# Altium schematic sheet PowerDistribution.SchDoc (part 2 of 3)
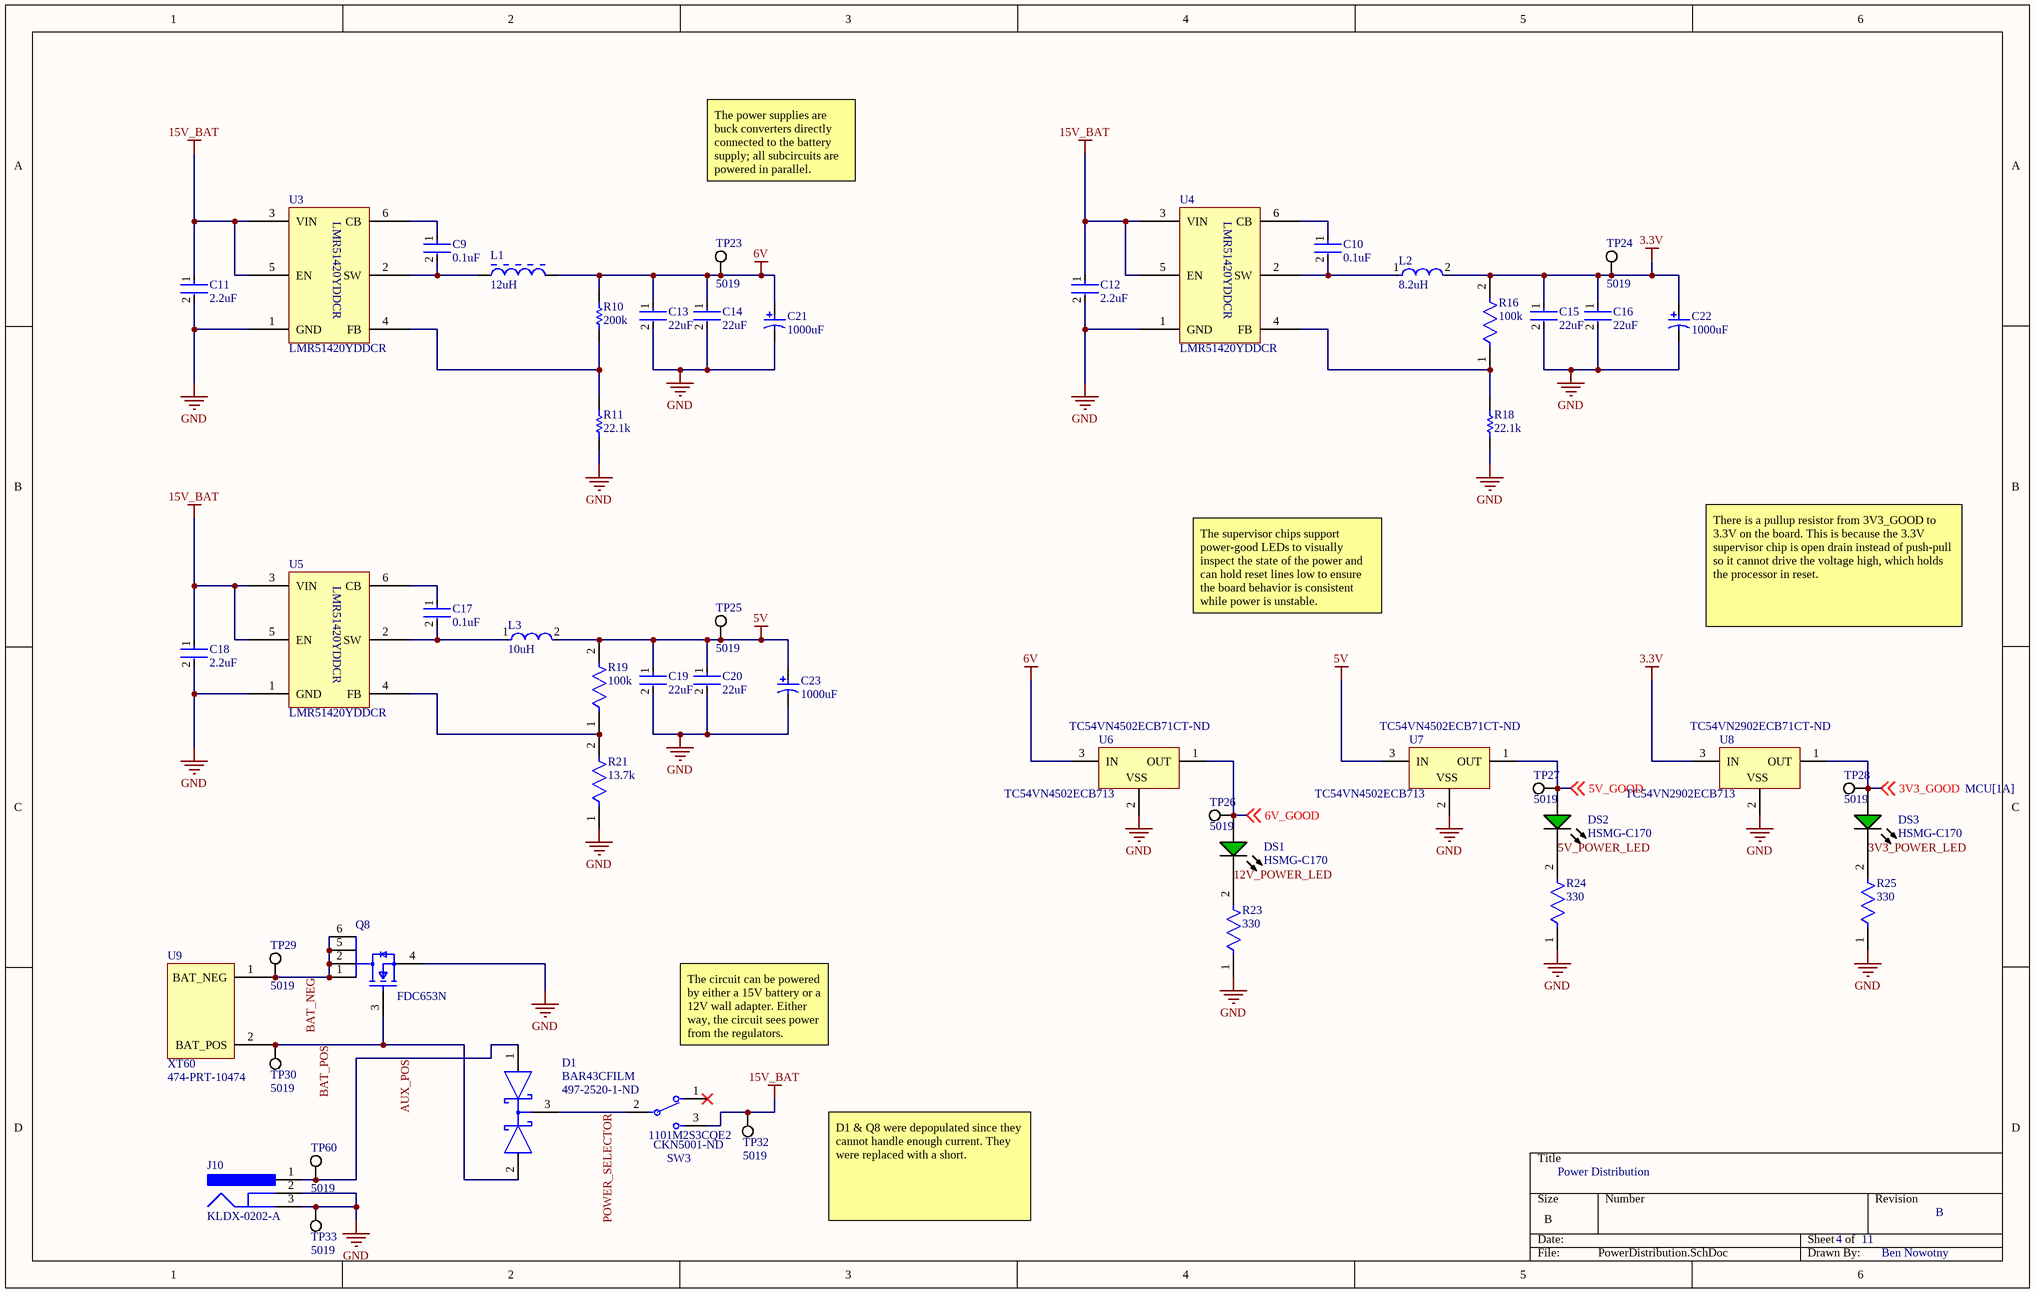
[diagram p1: PowerDistribution.SchDoc]
## Library data of the parts
C9 C10 C17 = CMP-1036-04410-2: CAP CER 0.1UF 25V X7R 0805; Manufacturer Part Number: CC0805KRX7R8BB104; Manufacturer: Yageo; Tolerance: 0.1; Material: Ceramic; Value: 100 nF; Insulation Resistance: 100GR; ComponentLink2URL: http://www.yageo.com/documents/recent/UPY-GPHC_Y5V_6.3V-to-50V_8.pdf; Category: Cap; Mouser Description: Multilayer Ceramic Capacitors MLCC - SMD/SMT 100nF 25V X7R 10%; Device Class L1: Passive Components; Footprint Url: http://www.yageo.com/exep/pages/download/literatures/UPY-C_GEN_24.pdf; Height: 0.95mm; Digikey Description: CAP CER 0.1UF 25V X7R 0805; Lead Free: Yes; Temperature Range High: +85°C; Temperature: -30°C to +85°C; Ipc Land Pattern Name: CAPC200125X85; Capacitance: 100 nF; Automotive: No; Octopart: https://octopart.com/cc0805krx7r8bb104-yageo-39467766; Device Class L2: Capacitors; Temperature Characteristic: X7R; Voltage Rating: 25 V; ComponentLink2Description: Datasheet; Temperature Range Low: -30°C; Device Class L3: Ceramic Capacitors; RoHS: TRUE; Package: CC0805-0.85; Supplier 1: Digi-Key; Supplier Part Number 1: 311-1141-1-ND; Stock 1: 1013369; Pricing 1: 1=0.11000, 10=0.07700, 50=0.04380, 100=0.03620, 500=0.02542, 1000=0.02104 (USD); Mount: Surface Mount; Case/Package: 0805; Number of Pins: 2; Case Code (Metric): 2012; Case Code (Imperial): 0805; Min Operating Temperature: -55°C; Max Operating Temperature: 125°C; Packaging: Tape and Reel; Voltage Rating (DC): 25V; Dielectric: X7R; Package Quantity: 4000; Termination: SMD/SMT; Series: CC; Resistor Type: Ceramic; Length: 2mm; Width: 1.25mm; Depth: 1.25mm; Thickness: 0.033inch; Radiation Hardening: No; RoHS Compliant: Yes; Reach SVHC Compliant: Yes; Halogen Free: Halogen Free; ComponentLink1URL: https://datasheet.ciiva.com/8034/70765-8034031.pdf?src-supplier=Element14; ComponentLink1Description: https://datasheet.ciiva.com/8034/70765-8034031.pdf?src-supplier=Element14; ComponentLink3URL: https://datasheet.ciiva.com/28450/1489800-28450789.pdf?src-supplier=Element14; ComponentLink3Description: https://datasheet.ciiva.com/28450/1489800-28450789.pdf?src-supplier=Element14; ComponentLink4URL: https://datasheet.ciiva.com/46430/1850775-46430166.pdf?src-supplier=Element14; ComponentLink4Description: https://datasheet.ciiva.com/46430/1850775-46430166.pdf?src-supplier=Element14; ComponentLink5URL: https://datasheet.ciiva.com/145/mlccorderingcode-145008.pdf?src-supplier=Digi-Key; ComponentLink5Description: https://datasheet.ciiva.com/145/mlccorderingcode-145008.pdf?src-supplier=Digi-Key; ComponentLink6URL: https://datasheet.ciiva.com/145/mlccorderingcode-145007.pdf?src-supplier=Digi-Key; ComponentLink6Description: https://datasheet.ciiva.com/145/mlccorderingcode-145007.pdf?src-supplier=Digi-Key; ComponentLink7URL: https://datasheet.ciiva.com/145/mlccorderingcode-145009.pdf?src-supplier=Digi-Key; ComponentLink7Description: https://datasheet.ciiva.com/145/mlccorderingcode-145009.pdf?src-supplier=Digi-Key; ComponentLink8URL: https://datasheet.ciiva.com/8034/1784427-8034030.pdf?src-supplier=Element14; ComponentLink8Description: https://datasheet.ciiva.com/8034/1784427-8034030.pdf?src-supplier=Element14
C11 C12 C18 = CMP-08246-001076-1: Cap Ceramic 2.2uF 35V X7R 10% Pad SMD 0805 +125°C Automotive T/R; Manufacturer: TDK; Manufacturer Part Number: CGA4J1X7R1V225K125AC; Width: 0.049inch; Ratings: AEC-Q200; Thickness: 0.057inch; Weight: 0.000194oz; Termination: SMD/SMT; Voltage Rating (DC): 35V; Height: 1.25mm; Case Code (Imperial): 0805; Max Operating Temperature: 125°C; Capacitance: 2.2uF; Dielectric: X7R; Packaging: Tape and Reel; Case Code (Metric): 2012; Voltage Rating: 35V; Mount: Surface Mount; Min Operating Temperature: -55°C; Composition: Ceramic; Tolerance: 10%; REACH SVHC: No SVHC; Case/Package: 0805; Length: 2mm; Depth: 1.25mm; Package Quantity: 1; Supplier 1: Newark; Supplier Part Number 1: 73AH9978; RoHS: Yes; Category: Ceramic Capacitors; Stock 1: 22000; Pricing 1: 1=0.11700, 2000=0.11300, 4000=0.10900, 8000=0.10500, 12000=0.10000 (USD); Series: CGA; Resistor Type: Ceramic; RoHS Compliant: Yes; Reach SVHC Compliant: Yes; ComponentLink1URL: https://datasheet.ciiva.com/24219/cga4j1x7r1v225k125ac-265990-24219578.pdf?src-supplier=Mouser; ComponentLink1Description: https://datasheet.ciiva.com/24219/cga4j1x7r1v225k125ac-265990-24219578.pdf?src-supplier=Mouser
C13-C16 C19 C20 = CMP-2007-03222-3: Chip Multilayer Ceramic Capacitors for General Purpose, 0805, 22uF, X5R, 15%, 20%, 25V; Manufacturer: Murata; Manufacturer Part Number: GRM21BR61E226ME44L; Case/Package: 0805; Depth: 1.25mm; Resistor Type: Ceramic; Voltage Rating: 25V; Lead Free: Lead Free; Voltage Rating (DC): 25V; Case Code (Metric): 2012; Thickness: 0.057inch; REACH SVHC: No SVHC; Material: Ceramic; Tolerance: 20%; Length: 2mm; Capacitance: 22uF; Case Code (Imperial): 0805; Max Operating Temperature: 85°C; Termination: SMD/SMT; Weight: 0.000335oz; Dielectric: X5R; Packaging: Tape and Reel; Voltage: 25V; Package Quantity: 3000; Height: 1.25mm; Mount: Surface Mount; Width: 1.25mm; Min Operating Temperature: -55°C; Supplier 1: Arrow Electronics; Supplier Part Number 1: GRM21BR61E226ME44L; RoHS: Yes; Category: Ceramic Capacitors; Stock 1: 774048; Pricing 1: 3000=0.06440, 6000=0.05980 (USD); Series: GRM; Construction: Flat; RoHS Compliant: Yes; Reach SVHC Compliant: Yes; ComponentLink1URL: http://uk.rs-online.com/webdocs/13d2/0900766b813d2ca1.pdf?src-supplier=Rs; ComponentLink1Description: http://uk.rs-online.com/webdocs/13d2/0900766b813d2ca1.pdf?src-supplier=Rs
C21-C23 = CMP-0687-00006-1: Aluminum Electrolytic Capacitor, UD Series, Low Impedance, 1000 uF, 10 V, + / - 20%, -55 to 105 degC, Chip Type, 10 x 10 mm D x L, Pb-Free, Reel; Manufacturer: Nichicon; PartNumber: UUD1A102MNL1GS; Rated Voltage: 10 V; Endurance Time: 5000 h; Impedance: 0.09 Ohm; Packing: Dia382mm Reel; Tolerance Rated Capacitance: -20 to 20%; Rated Ripple Current (at 100kHz): 670 mA; Dielectric Material: Aluminium; Voltage Rating (DC): 10V; Value: 1mF; Ripple Current: 670mA; Leakage Current: 3uA; Life (Hours): 5000Hour; Dissipation Factor: 0.24%; Lead Diameter: 1.1mm; DatasheetVersion: 08/2012; PackageReference: CAPAE-D10H10; PackageDescription: 2-Pin Surface Mount Device, Diameter 10 mm, Height 10 mm, Pitch 8 mm; ComponentLink3URL: http://products.nichicon.co.jp/en/pdf/XJA043/e-ud.pdf; ComponentLink2Description: Datasheet; Diameter: 10 mm; ComponentLink1Description: Manufacturer URL; RoHS: TRUE; ComponentLink2URL: http://products.nichicon.co.jp/en/pdf/XJA043/e-ud.pdf; Length: 10 mm; Rated Capacitance: 1000 uF; ComponentLink1URL: http://www.nichicon.co.jp/; Mounting Technology: Surface Mount; ComponentLink3Description: Package Specification; Supplier 1: Digi-Key; Supplier Part Number 1: 493-2254-1-ND; Manufacturer Part Number: UUD1A102MNL1GS; Category: Aluminum Electrolytic Capacitors; Stock 1: 3265; Pricing 1: 1=0.94000, 10=0.69100, 50=0.55260, 100=0.47360 (USD); Case/Package: Radial; Pins: 2; Min Operating Temperature: -55°C; Max Operating Temperature: 105°C; Tolerance: 20%; Package Quantity: 1; Packaging: Tape and Reel; Voltage Rating: 10V; Termination: SMD/SMT; Voltage: 10V; Series: UD; Construction: Cylindrical; Ripple Current (AC): 670mA; Height: 10mm; Height - Seated (Max): 0.394inch; Lead Pitch: 4.5mm; Radiation Hardening: No; Reach SVHC Compliant: Yes; RoHS Compliant: Yes; Lead Free: Lead Free; ComponentLink4URL: https://datasheet.ciiva.com/11781/0900766b80fa39e7-11781903.pdf?src-supplier=Rs; ComponentLink4Description: https://datasheet.ciiva.com/11781/0900766b80fa39e7-11781903.pdf?src-supplier=Rs; ComponentLink5URL: https://datasheet.ciiva.com/98/e-ud-98263.pdf?src-supplier=Digi-Key; ComponentLink5Description: https://datasheet.ciiva.com/98/e-ud-98263.pdf?src-supplier=Digi-Key; ComponentLink6URL: https://datasheet.ciiva.com/98/e-ud-98264.pdf?src-supplier=Digi-Key; ComponentLink6Description: https://datasheet.ciiva.com/98/e-ud-98264.pdf?src-supplier=Digi-Key; ComponentLink7URL: https://datasheet.ciiva.com/98/e-ud-98265.pdf?src-supplier=Digi-Key; ComponentLink7Description: https://datasheet.ciiva.com/98/e-ud-98265.pdf?src-supplier=Digi-Key; ComponentLink8URL: https://datasheet.ciiva.com/16502/e-ud-16502759.pdf?src-supplier=Future+Electronics; ComponentLink8Description: https://datasheet.ciiva.com/16502/e-ud-16502759.pdf?src-supplier=Future+Electronics; ComponentLink9URL: https://datasheet.ciiva.com/7793/66055-7793131.pdf?src-supplier=Element14; ComponentLink9Description: https://datasheet.ciiva.com/7793/66055-7793131.pdf?src-supplier=Element14; ComponentLink10URL: https://datasheet.ciiva.com/28458/e-ud-28458024.pdf?src-supplier=Element14; ComponentLink10Description: https://datasheet.ciiva.com/28458/e-ud-28458024.pdf?src-supplier=Element14; ComponentLink11URL: https://datasheet.ciiva.com/22693/66055-22693549.pdf?src-supplier=Element14; ComponentLink11Description: https://datasheet.ciiva.com/22693/66055-22693549.pdf?src-supplier=Element14
D1 = CMP-12187-000004-1: DIODE ARRAY SCHOTTKY 30V SOT23-3; Manufacturer: STMicroelectronics; Peak Reverse Current: 0.5uA; Forward Current: 0.1A; Standoff Height: 0mm; Capacitance: 7pF; Max Surge Forward Current: 0.75A; Value: 7pF; Max Junction Temp: +150°C; Element Configuration: Common Cathode; Max Reverse Current: 500nA; Forward Voltage: 1V; Average Rectified Current: 100mA; Max Forward Surge Current (Ifsm): 750mA; Power Dissipation: 250mW; Reverse Recovery Time: 5ns; ComponentLink2Description: Datasheet; Device Class L2: Diodes; Temperature Range High: +150°C; Device Class L1: Discrete Semiconductors; ComponentLink2URL: https://www.st.com/resource/en/datasheet/bar43.pdf; Package: SOT23-3L; Lead Free: Yes; Temperature: to +150°C; Category: Diode; Digikey Description: DIODE ARRAY SCHOTTKY 30V SOT23-3; Manufacturer Part Number: BAR43CFILM; Automotive: No; Mouser Description: Schottky Diodes & Rectifiers 100mA 30 Volt; Height: 1.5mm; Max Repetitive Reverse Voltage: 30V; RoHS: TRUE; Octopart: https://octopart.com/bar43cfilm-stmicroelectronics-39683191; Device Class L3: Schottky Diodes; Reverse Voltage: 30V; Supplier 1: Digi-Key; Stock 1: 13838; Pricing 1: 1=0.42000, 10=0.31200, 100=0.17680, 500=0.11712, 1000=0.08979 (USD); Mounting Technology: Surface Mount; Case/Package: SOT-23; Pins: 3; Contact Plating: Tin,Matte; Weight: 0.01lb; Min Operating Temperature: -65°C; Max Operating Temperature: 150°C; Packaging: Tape and Reel; Max Repetitive Reverse Voltage (Vrrm): 30V; Package Quantity: 1; Max Reverse Voltage (DC): 30V; Series: -; Peak Non-Repetitive Surge Current: 750mA; Current Rating: 100mA; Voltage Rating (DC): 30V; Termination: SMD/SMT; Length: 2.9mm; Width: 3.05mm; Radiation Hardening: No; RoHS Compliant: Yes; Reach SVHC Compliant: Yes; ComponentLink1URL: https://datasheet.ciiva.com/27050/869700-27050546.pdf?src-supplier=Jameco; ComponentLink1Description: https://datasheet.ciiva.com/27050/869700-27050546.pdf?src-supplier=Jameco; ComponentLink3URL: https://datasheet.ciiva.com/905/cd00000764-905866.pdf?src-supplier=Digi-Key; ComponentLink3Description: https://datasheet.ciiva.com/905/cd00000764-905866.pdf?src-supplier=Digi-Key; ComponentLink4URL: https://datasheet.ciiva.com/905/cd00000764-905867.pdf?src-supplier=Digi-Key; ComponentLink4Description: https://datasheet.ciiva.com/905/cd00000764-905867.pdf?src-supplier=Digi-Key; ComponentLink5URL: https://datasheet.ciiva.com/905/cd00000764-905868.pdf?src-supplier=Digi-Key; ComponentLink5Description: https://datasheet.ciiva.com/905/cd00000764-905868.pdf?src-supplier=Digi-Key; ComponentLink6URL: https://datasheet.ciiva.com/1199/1700360-1199952.pdf?src-supplier=Farnell; ComponentLink6Description: https://datasheet.ciiva.com/1199/1700360-1199952.pdf?src-supplier=Farnell; ComponentLink7URL: https://datasheet.ciiva.com/1199/1700360-1199953.pdf?src-supplier=Farnell; ComponentLink7Description: https://datasheet.ciiva.com/1199/1700360-1199953.pdf?src-supplier=Farnell; ComponentLink8URL: https://datasheet.ciiva.com/1177/1837092-1177592.pdf?src-supplier=Element14; ComponentLink8Description: https://datasheet.ciiva.com/1177/1837092-1177592.pdf?src-supplier=Element14; ComponentLink9URL: https://datasheet.ciiva.com/1177/1837092-1177593.pdf?src-supplier=Element14; ComponentLink9Description: https://datasheet.ciiva.com/1177/1837092-1177593.pdf?src-supplier=Element14; ComponentLink10URL: https://datasheet.ciiva.com/1177/1700360-1177594.pdf?src-supplier=Element14; ComponentLink10Description: https://datasheet.ciiva.com/1177/1700360-1177594.pdf?src-supplier=Element14; ComponentLink11URL: https://datasheet.ciiva.com/16205/cd00000764-16205466.pdf?src-supplier=Future+Electronics; ComponentLink11Description: https://datasheet.ciiva.com/16205/cd00000764-16205466.pdf?src-supplier=Future+Electronics; ComponentLink12URL: https://datasheet.ciiva.com/14558/70013844-14558997.pdf?src-supplier=Allied+Electronics; ComponentLink12Description: https://datasheet.ciiva.com/14558/70013844-14558997.pdf?src-supplier=Allied+Electronics
DS1-DS3 = CMP-2000-05062-1: Chip LED, Green, 2.2 V, -40 to 85 degC, 2-Pin SMD, Pb-Free, Tape and Reel; Manufacturer: Avago; No. of Pins: 2; Peak Wavelength: 570nm; SVHC: NoSVHC(16-Jun-2014); Dominant Wavelength: 572nm; Forward Current If: 20mA; Viewing Angle: 170deg; Lens Shape: Rectangular; PIV Max: 5V; External Width: 1.25mm; LED Type: Standard; External Depth: 0.8mm; Opto Mounting Orientation: Top; Luminous Intensity: 15mcd; Luminous Intensity Min: 4mcd; Forward Voltage VF Max: 2.6V; External Length / Height: 2mm; Bulb Size: 1.25mmx1.4mm; Light Area Height: 1mm; Voltage Vf Typ: 2.2V; Operating Temperature Max: 85degC; Datasheet Version: Oct-08; MSL: MSL2A-4weeks; Peak Forward Current: 20mA; Package Description: 2-Pin Surface Mount Device, Body 2 x 1.25 mm, Height 0.8 mm; Datasheet URL: https://datasheet.ciiva.com/29280/180495-da-01-en-chip-led-hsmg-c170-gelb-gruen-29280971.pdf; Storage Temperature Min: -40degC; LED Colour: Green; Wavelength Typ: 570nm; Mounting Type: SMD; Forward Current If Max: 20mA; Dominant Wavelength Typ: 572nm; LED Mounting: SMD; Operating Temperature Range: -30degCto+85degC; Operating Temperature Min: -30degC; Manufacturer URL: http://www.avagotech.com/; Packaging: CutTape; Luminous Intensity Typ: 15mcd; Package Reference: HSMX-C170; Storage Temperature Max: 85degC; Opto Case Style: SMD; Forward Voltage: 2.2V
J10 = CMP-1673-00001-5: DC Power Jack, 24 V, 3.5 A, -25 to 85 degC, 3-Pin THD, RoHS; Manufacturer: Kycon; Voltage Rating: 24 V; Current Rating: 3.5 A; Option: General Purpose; Rated Current (Power): 3.5A; Pin Diameter: 2mm; DIN Conformance: No; Height: 10.8 mm; Length: 9.2 mm; Pins: 2; Housing Material: PBT; Connector Type: Power; ComponentLink2URL: http://www.kycon.com/Pub_Eng_Draw/KLDX-0202-X.PDF; PackageDescription: 3-Pin Through Hole Device, Body 14.5 x 9 mm; Max Operating Temperature: 85 degC; Min Operating Temperature: -25 degC; PackageReference: KLDX-0202-A; Contact Gender: Female; Package Quantity: 500; Mount: Through Hole; Colour: Black; Contact Plating: Tin; DatasheetVersion: Rev. D3, 06/2013; ComponentLink2Description: Datasheet; RoHSCompliant: true; Mounting Technology: Through Hole; ComponentLink1Description: Manufacturer URL; Contact Material: Brass; ComponentLink1URL: http://www.kycon.com/; Supplier 1: Digi-Key; Supplier Part Number 1: 2092-KLDX-0202-A-ND; Manufacturer Part Number: KLDX-0202-A; RoHS: Yes; Category: Power Connectors; Stock 1: 37787; Pricing 1: 1=0.74000, 10=0.62400, 25=0.59800, 50=0.58540, 100=0.55990, 250=0.50904, 500=0.45814, 1000=0.40723, 2500=0.36906 (USD); Contact Finish - Mating: TIN; Contact Finish - Termination: Matte Tin (Sn); Body/Shell Style: JACK; Termination: Solder; JESD-609 Code: e3; IEC Conformance: No; MIL Conformance: No; Reach SVHC Compliant: Yes; RoHS Compliant: Yes; ComponentLink3URL: https://datasheet.ciiva.com:443/pdfs/VipMasterIC/IC/KYCO/KYCO-S-A0002840624/KYCO-S-A0002840624-1.pdf?src-supplier=IHS+Markit; ComponentLink3Description: https://datasheet.ciiva.com:443/pdfs/VipMasterIC/IC/KYCO/KYCO-S-A0002840624/KYCO-S-A0002840624-1.pdf?src-supplier=IHS+Markit; ComponentLink4URL: http://www.mouser.com/ds/2/222/KLDX_0202_LT-334784.pdf?src-supplier=Mouser; ComponentLink4Description: http://www.mouser.com/ds/2/222/KLDX_0202_LT-334784.pdf?src-supplier=Mouser; ComponentLink5URL: http://domino2.kycon.com/catalog_PDF/KLDX_0202.pdf?src-supplier=Avnet; ComponentLink5Description: http://domino2.kycon.com/catalog_PDF/KLDX_0202.pdf?src-supplier=Avnet
L1 = CMP-0904-00022-1: SDR0403 Series Power Inductor, 12 uF +/- 20 %, 0.21 Ohm, -40 to 125 degC, 2-Pin SMD, RoHS, Tape and Reel; PartNumber: SDR0403-120ML; Manufacturer: Bourns; I rms (A): 1.05 Max.; Q: 28; SRF (MHz): 30 Min.; RDC (Ohm): 0.21 Max.; Tolerance (%): +/- 20; Test Frequency (MHz): 2.52; Inductance (uH): 12; I sat (A): 1.6 Typ.; Core Material: Ferrite; Tolerance: 20%; Self Resonant Frequency: 30MHz; Shielding: Unshielded; DC Resistance (DCR): 210mR; Max DC Current: 1.05A; Test Frequency: 1kHz; Saturation Current: 1.6A; ComponentLink1URL: http://www.bourns.com/; Temperature Range: -40 to 125 degC; ComponentLink2URL: http://www.bourns.com/data/global/pdfs/sdr0403.pdf; Mounting Technology: Surface Mount; Packing: Tape and Reel; PackageDescription: 3-Pin SMD, Dia 4.5 mm, Height 3.5 mm; PackageReference: SDR0403-2; ComponentLink1Description: Manufacturer URL; DatasheetVersion: Feb-12; RoHS: TRUE; ComponentLink2Description: Datasheet; Supplier 1: Digi-Key; Supplier Part Number 1: SDR0403-120MLCT-ND; Manufacturer Part Number: SDR0403-120ML; Category: Fixed Inductors; Stock 1: 15023; Pricing 1: 1=0.62000, 10=0.54100, 25=0.50240, 50=0.42500, 100=0.38630, 250=0.36316, 500=0.32452, 1000=0.26270 (USD); Case/Package: Nonstandard; Min Operating Temperature: -40°C; Max Operating Temperature: 125°C; Value: 12uH; Packaging: Tape and Reel; Inductance Tolerance: 20%; Package Quantity: 2000; Termination: SMD/SMT; Series: SDR0403; RMS Current (Irms): 1.05A; Current Rating: 1.05A; Resistor Type: Wirewound; Q Factor: 28; DC Current: 1.05A; Sample Rate (Hz): 1kHz; Diameter: 4.5mm; Length: 0.177inch; Width: 0.157inch; Height: 3.2mm; Height - Seated (Max): 0.126inch; Depth: 4.3mm; Radiation Hardening: No; RoHS Compliant: Yes; Reach SVHC Compliant: Yes; Military Standard: Not; ComponentLink3URL: https://datasheet.ciiva.com/11802/0900766b80f2b590-11802704.pdf?src-supplier=Rs; ComponentLink3Description: https://datasheet.ciiva.com/11802/0900766b80f2b590-11802704.pdf?src-supplier=Rs; ComponentLink4URL: https://datasheet.ciiva.com/1049/sdr0403-1049176.pdf?src-supplier=Digi-Key; ComponentLink4Description: https://datasheet.ciiva.com/1049/sdr0403-1049176.pdf?src-supplier=Digi-Key; ComponentLink5URL: https://datasheet.ciiva.com/1049/sdr0403-1049177.pdf?src-supplier=Digi-Key; ComponentLink5Description: https://datasheet.ciiva.com/1049/sdr0403-1049177.pdf?src-supplier=Digi-Key; ComponentLink6URL: https://datasheet.ciiva.com/8516/sdr0403-8516071.pdf?src-supplier=Avnet; ComponentLink6Description: https://datasheet.ciiva.com/8516/sdr0403-8516071.pdf?src-supplier=Avnet; ComponentLink7URL: https://datasheet.ciiva.com/22715/1577668-22715399.pdf?src-supplier=Element14; ComponentLink7Description: https://datasheet.ciiva.com/22715/1577668-22715399.pdf?src-supplier=Element14; ComponentLink8URL: https://datasheet.ciiva.com/48956/70153447-48956700.pdf?src-supplier=Allied+Electronics; ComponentLink8Description: https://datasheet.ciiva.com/48956/70153447-48956700.pdf?src-supplier=Allied+Electronics; ComponentLink9URL: https://datasheet.ciiva.com/48690/001056067-da-01-en-leis-indukt-sdr0403-120ml-12uh-1-05a-48690955.pdf?src-supplier=Conrad; ComponentLink9Description: https://datasheet.ciiva.com/48690/001056067-da-01-en-leis-indukt-sdr0403-120ml-12uh-1-05a-48690955.pdf?src-supplier=Conrad
L2 = CMP-07248-000032-1: FIXED IND 8.2UH 2A 180 MOHM SMD; Manufacturer: Bourns; Manufacturer Part Number: SRP4020TA-8R2M; Tolerance: 20%; Shielding: true; Saturation Current: 2.5A; Core Material: Carbonyl Powder; Test Frequency: 100kHz; Series Resistance: 180mΩ; Self Resonant Frequency: 21MHz; Q Factor: 10; Automotive Grade: Grade 0; DC Resistance (DCR): 180mR; Rms Current: 2A; Temperature Range Low: -40°C; Device Class L1: Passive Components; Temperature Range High: +150°C; ComponentLink2URL: https://www.bourns.com/docs/Product-Datasheets/SRP4020TA.pdf; Package: SRP4020TA; Height: 2.1mm; Automotive: Yes; Digikey Description: FIXED IND 8.2UH 2A 180 MOHM SMD; Device Class L3: Fixed Inductors; Device Class L2: Inductors; Temperature: -40°C to +150°C; Composition: Wirewound; Inductance: 8.2uH; Lead Free: Yes; Mouser Description: Fixed Inductors 8.2uH 20% SMD 4020 AEC-Q200; Category: Ind; RoHS: TRUE; Value: 8.2uH; ComponentLink2Description: Datasheet; Octopart: https://octopart.com/srp4020ta-8r2m-bourns-47300342; Supplier 1: Digi-Key; Supplier Part Number 1: SRP4020TA-8R2MCT-ND; Stock 1: 13839; Pricing 1: 1=1.35000, 10=1.25700, 25=1.16040, 50=0.96700, 100=0.90910, 250=0.81236, 500=0.69630, 1000=0.61893 (USD); Mount: Surface Mount; Case/Package: SMD/SMT; Number of Pins: 2; Weight: 0.005291oz; Min Operating Temperature: -40°C; Max Operating Temperature: 150°C; Inductance Tolerance: 20%; Packaging: Tape and Reel; Current Rating: 2A; Max DC Current: 2.5A; Package Quantity: 3000; Series: SRP4020TA; Termination: SMD/SMT; RMS Current (Irms): 2A; Resistor Type: Wirewound; Length: 0.175inch; Width: 4.06mm; Height - Seated (Max): 0.079inch; Depth: 4.06mm; Ratings: AEC-Q200; RoHS Compliant: Yes; Reach SVHC Compliant: Yes; ComponentLink1URL: https://datasheet.ciiva.com/46437/1839010-46437192.pdf?src-supplier=Element14; ComponentLink1Description: https://datasheet.ciiva.com/46437/1839010-46437192.pdf?src-supplier=Element14; ComponentLink3URL: https://datasheet.ciiva.com/46437/1839010-46437191.pdf?src-supplier=Element14; ComponentLink3Description: https://datasheet.ciiva.com/46437/1839010-46437191.pdf?src-supplier=Element14
L3 = CMP-14484-000421-1: SMD Inductors 10uH ±10% 0.15A 0.468Ω 0805; Manufacturer: Taiyo Yuden; Manufacturer Part Number: LBR2012T100K; DC Current: 150mA; Core Material: Ferrite; Shielding: Unshielded; Test Frequency: 2.52MHz; DC Resistance (DCR): 360mR; Self Resonant Frequency: 32MHz; Military Standard: Not; Termination: SMD/SMT; Height - Seated (Max): 0.057inch; Current Rating: 150mA; Tolerance: 10%; Case Code (Imperial): 0805; Radiation Hardening: No; Inductance: 10uH; Resistor Type: Wirewound; Length: 0.079inch; Weight: 0.000194oz; Case Code (Metric): 2012; Max Operating Temperature: 105°C; Height: 1.6mm; Packaging: Tape and Reel; Lead Pitch: 1mm; Case/Package: 0805; Depth: 1.45mm; Series: LB; Mount: Surface Mount; Min Operating Temperature: -40°C; Inductance Tolerance: 10%; RoHS Compliant: Yes; Max DC Current: 150mA; Package Quantity: 3000; Lead Free: Lead Free; Width: 1.6mm; Halogen Free: Halogen Free; Supplier 1: Digi-Key; Supplier Part Number 1: 587-2045-1-ND; RoHS: Yes; Category: Fixed Inductors; Stock 1: 225887; Pricing 1: 1=0.13000, 10=0.11400, 25=0.10080, 50=0.08580, 100=0.07580, 250=0.06944, 500=0.06312, 1000=0.05302 (USD); ComponentLink1URL: https://datasheet.ciiva.com/28479/1521622-28479584.pdf?src-supplier=Element14; ComponentLink1Description: https://datasheet.ciiva.com/28479/1521622-28479584.pdf?src-supplier=Element14; ComponentLink2URL: https://datasheet.ciiva.com/1038/lbr2012t100k-ss-1038898.pdf?src-supplier=Digi-Key; ComponentLink2Description: https://datasheet.ciiva.com/1038/lbr2012t100k-ss-1038898.pdf?src-supplier=Digi-Key; ComponentLink3URL: https://datasheet.ciiva.com/3082/lbr2012t100k-ss-3082080.pdf?src-supplier=Avnet; ComponentLink3Description: https://datasheet.ciiva.com/3082/lbr2012t100k-ss-3082080.pdf?src-supplier=Avnet; ComponentLink4URL: https://datasheet.ciiva.com/15986/291lbr2012t100k-15986593.pdf?src-supplier=Onlinecomponents.com; ComponentLink4Description: https://datasheet.ciiva.com/15986/291lbr2012t100k-15986593.pdf?src-supplier=Onlinecomponents.com
Q8 = CMP-07173-000050-1: MOSFET N-CH 30V 5A SSOT-6; Manufacturer: ON Semiconductor; Drain To Source Resistance: 0.027Ω; Max Forward Diode Voltage: 1.2V; Turn Off Delay Time: 13ns; Rthja Max: 78°C/W; Typ Forward Diode Voltage: 0.75V; Pulse Drain Current: 15A; Power Dissipation: 1.6W; Gate Charge At Vgs: 12nC @ 10V; Gate To Source Voltage: 20V; Input Capacitace At Vds: 350pF @ 15V; Max Junction Temp: +150°C; Turn On Delay Time: 7.5ns; Number Of Channels: 1; Transconductance: 6.2S; Threshold Vgs Min: 1V; Threshold Vgs Max: 2V; Depletion Mode: False; Standoff Height: 0mm; Height: 1.1mm; Device Class L2: Transistors; ComponentLink2URL: https://www.onsemi.com/pub/Collateral/FDC653N-D.pdf; Temperature: -55°C to +150°C; Mouser Description: Supplied as a Tape, FDC653N N-Channel MOSFET, 5 A, 30 V, 6-Pin SOT-23 ON Semiconductor; Drain To Source Breakdown Voltage: 30V; Category: Trans; Drain To Source Voltage: 30V; Digikey Description: MOSFET N-CH 30V 5A SSOT-6; Automotive: No; ComponentLink2Description: Datasheet; Device Class L1: Discrete Semiconductors; Manufacturer Part Number: FDC653N; Footprint Url: https://www.onsemi.com/pub/Collateral/419BL.PDF; Continuous Drain Current: 5A; Lead Free: Yes; RoHS: TRUE; Number Of N Channels: 1; Ipc Land Pattern Name: SOT95P280X100-6; Package: 419BL; Temperature Range High: +150°C; Temperature Range Low: -55°C; Octopart: https://octopart.com/fdc653n-on+semiconductor-84325763; Device Class L3: MOSFETs
R10 = CMP-2001-03660-1: Part Number: CRCW0805200KFKEA; Manufacturer: Vishay Dale; Tolerance: 1%; Power Rating: 125mW; Value: 200kR; Voltage Rating: 150V; Temperature Coefficient: 100ppm/°C; Supplier 1: Digi-Key; Supplier Part Number 1: 541-200KCCT-ND; Manufacturer Part Number: CRCW0805200KFKEA; RoHS: Yes; Category: Chip SMD Resistors; Stock 1: 34940; Pricing 1: 1=0.10000, 10=0.06700, 100=0.02710, 1000=0.01219, 2500=0.01058 (USD); Case/Package: 0805; Case Code (Metric): 2012; Case Code (Imperial): 0805; Contact Plating: Tin; Weight: 0.000194oz; Min Operating Temperature: -55°C; Max Operating Temperature: 155°C; Resistor Type: Thick Film; Packaging: Tape and Reel; Package Quantity: 10; Number of Terminations: 2; Termination: SMD/SMT; Max Power Dissipation: 125mW; Voltage Rating (DC): 150V; Features: Automotive AEC-Q200; Series: CRCW; Construction: Rectangular; Technology: THICK FILM; Resistance Tolerance: 1%; Length: 2mm; Width: 0.049inch; Height: 0.45mm; Depth: 1.25mm; Ratings: AEC-Q200; Radiation Hardening: No; Military Standard: Not; Lead Free: Lead Free; RoHS Compliant: Yes; ComponentLink1URL: https://datasheet.ciiva.com/11809/0900766b80d98b26-11809762.pdf?src-supplier=Rs; ComponentLink1Description: https://datasheet.ciiva.com/11809/0900766b80d98b26-11809762.pdf?src-supplier=Rs; ComponentLink2URL: https://datasheet.ciiva.com/3258/dcrcwe3-3258299.pdf?src-supplier=Avnet; ComponentLink2Description: https://datasheet.ciiva.com/3258/dcrcwe3-3258299.pdf?src-supplier=Avnet; ComponentLink3URL: https://datasheet.ciiva.com/3258/dcrcwe3-3258300.pdf?src-supplier=Avnet; ComponentLink3Description: https://datasheet.ciiva.com/3258/dcrcwe3-3258300.pdf?src-supplier=Avnet; ComponentLink4URL: https://datasheet.ciiva.com/2514/dcrcwe3-2514355.pdf?src-supplier=Digi-Key; ComponentLink4Description: https://datasheet.ciiva.com/2514/dcrcwe3-2514355.pdf?src-supplier=Digi-Key; ComponentLink5URL: https://datasheet.ciiva.com/2514/dcrcwe3-2514356.pdf?src-supplier=Digi-Key; ComponentLink5Description: https://datasheet.ciiva.com/2514/dcrcwe3-2514356.pdf?src-supplier=Digi-Key; ComponentLink6URL: https://datasheet.ciiva.com/2514/dcrcwe3-2514357.pdf?src-supplier=Digi-Key; ComponentLink6Description: https://datasheet.ciiva.com/2514/dcrcwe3-2514357.pdf?src-supplier=Digi-Key; ComponentLink7URL: https://datasheet.ciiva.com/7714/1697337-7714298.pdf?src-supplier=Element14; ComponentLink7Description: https://datasheet.ciiva.com/7714/1697337-7714298.pdf?src-supplier=Element14; ComponentLink8URL: https://datasheet.ciiva.com/16427/dcrcwe3-16427628.pdf?src-supplier=Future+Electronics; ComponentLink8Description: https://datasheet.ciiva.com/16427/dcrcwe3-16427628.pdf?src-supplier=Future+Electronics; ComponentLink9URL: https://datasheet.ciiva.com/7714/1720486-7714381.pdf?src-supplier=Element14; ComponentLink9Description: https://datasheet.ciiva.com/7714/1720486-7714381.pdf?src-supplier=Element14; ComponentLink10URL: https://datasheet.ciiva.com/16721/70201119-16721487.pdf?src-supplier=Allied+Electronics; ComponentLink10Description: https://datasheet.ciiva.com/16721/70201119-16721487.pdf?src-supplier=Allied+Electronics; ComponentLink11URL: https://datasheet.ciiva.com/16787/70201119-16787767.pdf?src-supplier=Allied+Electronics; ComponentLink11Description: https://datasheet.ciiva.com/16787/70201119-16787767.pdf?src-supplier=Allied+Electronics
R11 = CMP-2001-00049-1: Part Number: ERJ-6ENF2212V; Manufacturer: Panasonic; Value: 22.1kR; Power Rating: 125mW; Tolerance: 1%; Voltage Rating: 150V; Temperature Coefficient: 100ppm/°C; Supplier 1: Digi-Key; Supplier Part Number 1: P22.1KCCT-ND; Manufacturer Part Number: ERJ-6ENF2212V; RoHS: Yes; Category: Chip SMD Resistors; Stock 1: 163702; Pricing 1: 1=0.10000, 10=0.09200, 100=0.03540, 1000=0.01558, 2500=0.01345 (USD); Mounting Technology: Surface Mount; Case/Package: 0805; Case Code (Metric): 2012; Case Code (Imperial): 0805; Contact Plating: Tin; Weight: 0.000194oz; Min Operating Temperature: -55°C; Max Operating Temperature: 155°C; Packaging: Tape and Reel; Termination: SMD/SMT; Max Power Dissipation: 125mW; Series: ERJ; Resistance Tolerance: 1%; Resistor Type: Thick Film; Number of Terminations: 2; Voltage Rating (DC): 150V; Package Quantity: 1; Features: Automotive AEC-Q200; Technology: THICK FILM; Construction: Rectangular; Length: 2mm; Width: 1.2mm; Height: 0.6mm; Depth: 1.25mm; Radiation Hardening: No; Reach SVHC Compliant: Yes; Lead Free: Lead Free; RoHS Compliant: Yes; Military Standard: Not; ComponentLink1URL: https://datasheet.ciiva.com/11821/0900766b80f80784-11821597.pdf?src-supplier=Rs; ComponentLink1Description: https://datasheet.ciiva.com/11821/0900766b80f80784-11821597.pdf?src-supplier=Rs
R16 R19 = CMP-2100-03668-5: RES 100K OHM 1% 1/8W 0805; Manufacturer: Yageo; Manufacturer Part Number: RC0805FR-07100KL; Power Rating: 125mW; Temperature Coefficient: 100ppm/°C; Voltage Rating (DC): 150V; Resistance: 100kR; Package Quantity: 1; Case/Package: 0805; Lead Pitch: 0.4mm; Case Code (Imperial): 0805; Construction: Rectangular; Number of Terminations: 2; RoHS Compliant: Yes; Max Power Dissipation: 125mW; Tolerance: 1%; Max Operating Temperature: 155°C; Resistance Tolerance: 1%; Lead Free: Lead Free; Packaging: Tape and Reel; Resistor Type: Thick Film; Min Operating Temperature: -55°C; Case Code (Metric): 2012; Series: RC; Technology: THICK FILM; Voltage Rating: 150V; Termination: SMD/SMT; Width: 0.049inch; Number of Pins: 2; Features: Moisture Resistant; Military Standard: Not; Length: 0.079inch; Depth: 1.25mm; Size Code: 0805; Height: 0.024inch; Supplier 1: Digi-Key; Supplier Part Number 1: 311-100KCRCT-ND; RoHS: Yes; Category: Chip SMD Resistors; Stock 1: 5914890; Pricing 1: 1=0.10000, 10=0.03300, 100=0.01330, 1000=0.00600, 2500=0.00520 (USD)
R18 = CMP-2001-00049-1: Part Number: ERJ-6ENF2212V; Manufacturer: Panasonic; Resistance: 22.1kR; Tolerance: 1%; Temperature Coefficient: 100ppm/°C; Power Rating: 125mW; Voltage Rating (DC): 150V; Supplier 1: Digi-Key; Supplier Part Number 1: P22.1KCCT-ND; Manufacturer Part Number: ERJ-6ENF2212V; RoHS: Yes; Category: Chip SMD Resistors; Stock 1: 158902; Pricing 1: 1=0.10000, 10=0.09200, 100=0.03540, 1000=0.01558, 2500=0.01345 (USD); Mount: Surface Mount; Case/Package: 0805; Case Code (Metric): 2012; Case Code (Imperial): 0805; Contact Plating: Tin; Size Code: 0805; Weight: 0.000194oz; Min Operating Temperature: -55°C; Max Operating Temperature: 155°C; Packaging: Tape and Reel; Resistor Type: Thick Film; Number of Terminations: 2; Max Power Dissipation: 125mW; Series: ERJ; Voltage Rating: 150V; Package Quantity: 1; Termination: SMD/SMT; Features: Automotive AEC-Q200; Construction: Rectangular; Resistance Tolerance: 1%; Technology: THICK FILM; Length: 2mm; Width: 1.2mm; Height: 0.6mm; Depth: 1.25mm; Radiation Hardening: No; RoHS Compliant: Yes; Lead Free: Lead Free; Military Standard: Not; Reach SVHC Compliant: Yes; ComponentLink1URL: https://datasheet.ciiva.com/11821/0900766b80f80784-11821597.pdf?src-supplier=Rs; ComponentLink1Description: https://datasheet.ciiva.com/11821/0900766b80f80784-11821597.pdf?src-supplier=Rs; ComponentLink2URL: https://datasheet.ciiva.com/36526/1989172-36526235.pdf?src-supplier=Jameco; ComponentLink2Description: https://datasheet.ciiva.com/36526/1989172-36526235.pdf?src-supplier=Jameco; ComponentLink3URL: https://datasheet.ciiva.com/43460/426256-43460056.pdf?src-supplier=Farnell; ComponentLink3Description: https://datasheet.ciiva.com/43460/426256-43460056.pdf?src-supplier=Farnell; ComponentLink4URL: https://datasheet.ciiva.com/6064/426256-6064649.pdf?src-supplier=Farnell; ComponentLink4Description: https://datasheet.ciiva.com/6064/426256-6064649.pdf?src-supplier=Farnell; ComponentLink5URL: https://datasheet.ciiva.com/46377/426256-46377962.pdf?src-supplier=Element14; ComponentLink5Description: https://datasheet.ciiva.com/46377/426256-46377962.pdf?src-supplier=Element14; ComponentLink6URL: https://datasheet.ciiva.com/28693/1678782-28693597.pdf?src-supplier=Element14; ComponentLink6Description: https://datasheet.ciiva.com/28693/1678782-28693597.pdf?src-supplier=Element14; ComponentLink7URL: https://datasheet.ciiva.com/24158/aoa0000ce2-24158937.pdf?src-supplier=Mouser; ComponentLink7Description: https://datasheet.ciiva.com/24158/aoa0000ce2-24158937.pdf?src-supplier=Mouser; ComponentLink8URL: https://datasheet.ciiva.com/16724/70260748-16724650.pdf?src-supplier=Allied+Electronics; ComponentLink8Description: https://datasheet.ciiva.com/16724/70260748-16724650.pdf?src-supplier=Allied+Electronics; ComponentLink9URL: https://datasheet.ciiva.com/16782/70260748-16782763.pdf?src-supplier=Allied+Electronics; ComponentLink9Description: https://datasheet.ciiva.com/16782/70260748-16782763.pdf?src-supplier=Allied+Electronics; ComponentLink10URL: https://datasheet.ciiva.com/9191/aoa0000ce2-9191797.pdf?src-supplier=Avnet; ComponentLink10Description: https://datasheet.ciiva.com/9191/aoa0000ce2-9191797.pdf?src-supplier=Avnet; ComponentLink11URL: https://datasheet.ciiva.com/30201/aoa0000ce2-30201590.pdf?src-supplier=Onlinecomponents.com; ComponentLink11Description: https://datasheet.ciiva.com/30201/aoa0000ce2-30201590.pdf?src-supplier=Onlinecomponents.com
R21 = CMP-2001-04947-2: RES Thick Film, 13.7kΩ, 1%, 0.125W, 100ppm/°C, 0805; Manufacturer: Vishay; Manufacturer Part Number: CRCW080513K7FKEA; Voltage Rating (DC): 150V; Max Power Dissipation: 125mW; Resistance: 13.7kR; Min Operating Temperature: -55°C; Composition: Thick Film; Contact Plating: Tin; Depth: 1.25mm; Max Operating Temperature: 155°C; Case Code (Metric): 2012; Lead Free: Lead Free; Tolerance: 1%; Case Code (Imperial): 0805; Voltage Rating: 150V; Weight: 0.000194oz; Case/Package: 0805; Radiation Hardening: No; Package Quantity: 10; Features: Automotive AEC-Q200; Temperature Coefficient: 100ppm/°C; Width: 0.049inch; Packaging: Tape and Reel; Number of Pins: 2; Termination: SMD/SMT; Height: 0.45mm; Number of Terminations: 2; Power Rating: 125mW; Length: 2mm; Military Standard: Not; Supplier 1: Digi-Key; Supplier Part Number 1: 541-13.7KCCT-ND; RoHS: Yes; Category: Chip SMD Resistors; Stock 1: 15384; Pricing 1: 1=0.10000, 10=0.06700, 100=0.02710, 1000=0.01219, 2500=0.01058 (USD); Size Code: 0805; Resistor Type: Thick Film; Series: CRCW; Resistance Tolerance: 1%; Construction: Rectangular; Technology: THICK FILM; RoHS Compliant: Yes; ComponentLink1URL: https://datasheet.ciiva.com/11810/0900766b80d98b26-11810040.pdf?src-supplier=Rs; ComponentLink1Description: https://datasheet.ciiva.com/11810/0900766b80d98b26-11810040.pdf?src-supplier=Rs; ComponentLink2URL: https://datasheet.ciiva.com/2467/dcrcwe3-2467845.pdf?src-supplier=Digi-Key; ComponentLink2Description: https://datasheet.ciiva.com/2467/dcrcwe3-2467845.pdf?src-supplier=Digi-Key; ComponentLink3URL: https://datasheet.ciiva.com/2467/dcrcwe3-2467846.pdf?src-supplier=Digi-Key; ComponentLink3Description: https://datasheet.ciiva.com/2467/dcrcwe3-2467846.pdf?src-supplier=Digi-Key; ComponentLink4URL: https://datasheet.ciiva.com/2467/dcrcwe3-2467847.pdf?src-supplier=Digi-Key; ComponentLink4Description: https://datasheet.ciiva.com/2467/dcrcwe3-2467847.pdf?src-supplier=Digi-Key; ComponentLink5URL: https://datasheet.ciiva.com/3258/dcrcwe3-3258107.pdf?src-supplier=Avnet; ComponentLink5Description: https://datasheet.ciiva.com/3258/dcrcwe3-3258107.pdf?src-supplier=Avnet; ComponentLink6URL: https://datasheet.ciiva.com/5543/dcrcwe3-109170-5543941.pdf?src-supplier=Mouser; ComponentLink6Description: https://datasheet.ciiva.com/5543/dcrcwe3-109170-5543941.pdf?src-supplier=Mouser; ComponentLink7URL: https://datasheet.ciiva.com/7663/1697337-7663928.pdf?src-supplier=Element14; ComponentLink7Description: https://datasheet.ciiva.com/7663/1697337-7663928.pdf?src-supplier=Element14; ComponentLink8URL: https://datasheet.ciiva.com/16396/dcrcw-16396310.pdf?src-supplier=Future+Electronics; ComponentLink8Description: https://datasheet.ciiva.com/16396/dcrcw-16396310.pdf?src-supplier=Future+Electronics; ComponentLink9URL: https://datasheet.ciiva.com/22675/1847332-22675191.pdf?src-supplier=Element14; ComponentLink9Description: https://datasheet.ciiva.com/22675/1847332-22675191.pdf?src-supplier=Element14; ComponentLink10URL: https://datasheet.ciiva.com/16778/70201119-16778860.pdf?src-supplier=Allied+Electronics; ComponentLink10Description: https://datasheet.ciiva.com/16778/70201119-16778860.pdf?src-supplier=Allied+Electronics
R23-R25 = CMP-2001-03823-2: RES Thick Film, 330Ω, 1%, 0.125W, 100ppm/°C, 0805; Manufacturer: Vishay; Manufacturer Part Number: CRCW0805330RFKEA; Voltage Rating (DC): 150V; Resistance: 330R; Max Power Dissipation: 125mW; Mount: Surface Mount; Packaging: Tape and Reel; Min Operating Temperature: -55°C; Military Standard: Not; Case Code (Metric): 2012; Height: 0.02inch; Voltage Rating: 150V; Case/Package: 0805; Max Operating Temperature: 155°C; Width: 0.049inch; Case Code (Imperial): 0805; Termination: SMD/SMT; Lead Free: Lead Free; Contact Plating: Tin; Package Quantity: 10; Composition: Thick Film; Length: 2mm; Features: Automotive AEC-Q200; Depth: 1.25mm; Weight: 0.000194oz; Tolerance: 1%; Power Rating: 125mW; Number of Terminations: 2; Temperature Coefficient: 100ppm/°C; Supplier 1: Digi-Key; Supplier Part Number 1: 541-330CCT-ND; RoHS: Yes; Category: Chip SMD Resistors; Stock 1: 1889; Pricing 1: 1=0.10000, 10=0.06700, 100=0.02710, 1000=0.01219, 2500=0.01058 (USD); Size Code: 0805; Series: CRCW; Resistor Type: Thick Film; Construction: Rectangular; Resistance Tolerance: 1%; Ratings: AEC-Q200; RoHS Compliant: Yes; ComponentLink1URL: https://datasheet.ciiva.com/8944/dcrcwe3-8944773.pdf?src-supplier=Avnet; ComponentLink1Description: https://datasheet.ciiva.com/8944/dcrcwe3-8944773.pdf?src-supplier=Avnet; ComponentLink2URL: https://datasheet.ciiva.com/8944/dcrcwe3-8944776.pdf?src-supplier=Avnet; ComponentLink2Description: https://datasheet.ciiva.com/8944/dcrcwe3-8944776.pdf?src-supplier=Avnet; ComponentLink3URL: https://datasheet.ciiva.com/2495/dcrcwe3-2495803.pdf?src-supplier=Digi-Key; ComponentLink3Description: https://datasheet.ciiva.com/2495/dcrcwe3-2495803.pdf?src-supplier=Digi-Key; ComponentLink4URL: https://datasheet.ciiva.com/2495/dcrcwe3-2495804.pdf?src-supplier=Digi-Key; ComponentLink4Description: https://datasheet.ciiva.com/2495/dcrcwe3-2495804.pdf?src-supplier=Digi-Key; ComponentLink5URL: https://datasheet.ciiva.com/2495/dcrcwe3-2495805.pdf?src-supplier=Digi-Key; ComponentLink5Description: https://datasheet.ciiva.com/2495/dcrcwe3-2495805.pdf?src-supplier=Digi-Key; ComponentLink6URL: https://datasheet.ciiva.com/5545/dcrcwe3-109170-5545357.pdf?src-supplier=Mouser; ComponentLink6Description: https://datasheet.ciiva.com/5545/dcrcwe3-109170-5545357.pdf?src-supplier=Mouser; ComponentLink7URL: https://datasheet.ciiva.com/16769/70201119-16769852.pdf?src-supplier=Allied+Electronics; ComponentLink7Description: https://datasheet.ciiva.com/16769/70201119-16769852.pdf?src-supplier=Allied+Electronics; ComponentLink8URL: https://datasheet.ciiva.com/7777/1697337-7777390.pdf?src-supplier=Element14; ComponentLink8Description: https://datasheet.ciiva.com/7777/1697337-7777390.pdf?src-supplier=Element14; ComponentLink9URL: https://datasheet.ciiva.com/7777/1720486-7777573.pdf?src-supplier=Element14; ComponentLink9Description: https://datasheet.ciiva.com/7777/1720486-7777573.pdf?src-supplier=Element14
SW3 = CMP-10038-000019-1: SWITCH SLIDE SPDT 6A 120V; Manufacturer: ITT C&K; Switch Travel: 2.16mm; Number of Positions: 3; Number of Poles: 1; Approvals: UL; Actuator Length: 5.08mm; Voltage Rating (DC): 28V; Max Voltage Rating (AC): 250V; Insulation Resistance: 1GR; Body Material: Stainless Steel; Actuator Type: Standard; Contact Resistance: 10mR; Switch Function: On-On; Actuator Material: Nylon; Actuator Color: Black; Electrical Life: 40000Cycles; Termination: PC Pins; Packaging: Bulk; Housing Material: Stainless Steel; Flammability Rating: UL94 V-0; Series: 1000; Contact Current Rating: 6A; Length: 12.7mm; Depth: 6.6mm; Orientation: Vertical; Max Current Rating: 6A; Max Operating Temperature: 65°C; Throw Configuration: SPDT; REACH SVHC: No SVHC; Contact Material: Copper; Max Voltage Rating (DC): 28V; Lead Free: Lead Free; Current Rating: 6A; Voltage Rating (AC): 120V; Contact Plating: Silver; Package Quantity: 1; Min Operating Temperature: -30°C; Mount: Through Hole; Supplier 1: Digi-Key; Manufacturer Part Number: 1101M2S3CQE2; RoHS: Yes; Category: Slide Switches; Stock 1: 33215; Pricing 1: 1=4.21000, 10=4.03300, 25=3.68200, 100=3.19110, 250=2.89304, 500=2.68264, 1000=2.48977, 2500=2.26184 (USD); Mounting Technology: Through Hole,PCB; Reach SVHC Compliant: Yes; RoHS Compliant: Yes; ComponentLink1URL: https://datasheet.ciiva.com/1223/1719937-1223387.pdf?src-supplier=Element14; ComponentLink1Description: https://datasheet.ciiva.com/1223/1719937-1223387.pdf?src-supplier=Element14; ComponentLink2URL: https://datasheet.ciiva.com/1194/1000-30jul14-1194577.pdf?src-supplier=Newark; ComponentLink2Description: https://datasheet.ciiva.com/1194/1000-30jul14-1194577.pdf?src-supplier=Newark; ComponentLink3URL: https://datasheet.ciiva.com/8082/1000-30jul14-8082473.pdf?src-supplier=Avnet; ComponentLink3Description: https://datasheet.ciiva.com/8082/1000-30jul14-8082473.pdf?src-supplier=Avnet; ComponentLink4URL: https://datasheet.ciiva.com/16173/1000-30jul14-16173941.pdf?src-supplier=Onlinecomponents.com; ComponentLink4Description: https://datasheet.ciiva.com/16173/1000-30jul14-16173941.pdf?src-supplier=Onlinecomponents.com; ComponentLink5URL: https://datasheet.ciiva.com/16364/1101m2s3cqe2-16364332.pdf?src-supplier=Future+Electronics; ComponentLink5Description: https://datasheet.ciiva.com/16364/1101m2s3cqe2-16364332.pdf?src-supplier=Future+Electronics; ComponentLink6URL: https://datasheet.ciiva.com/26917/getdatasheetpartid-92693-26917622.pdf?src-supplier=Verical; ComponentLink6Description: https://datasheet.ciiva.com/26917/getdatasheetpartid-92693-26917622.pdf?src-supplier=Verical
TP23-TP30 TP32 TP33 TP60 = CMP-1672-00008-1: Test Point, 1 Position SMD, RoHS, Tape and Reel; Manufacturer: Keystone Electronics; Body Material: Bronze; Plating: Silver; ComponentLink1Description: Manufacturer URL; Package Quantity: 1000; DatasheetVersion: 03/2014; Packaging: Tape and Reel; ComponentLink2URL: http://www.keyelco.com/product-pdf.cfm?p=1357; ComponentLink1URL: http://www.keyelco.com/; Mount: Surface Mount; Contact Plating: Silver; PackageDescription: 1-Pin Surface Mount Device, Body 3.81 x 2.03 mm; Pins: 1; RoHSCompliant: True; Mounting Technology: Surface Mount; ComponentLink2Description: Datasheet; PackageReference: 5019; Supplier 1: Digi-Key; Supplier Part Number 1: 36-5019CT-ND; Manufacturer Part Number: 5019; RoHS: Yes; Category: Connectors; Stock 1: 1009631; Pricing 1: 1=0.34000, 25=0.27360, 100=0.22340, 250=0.20064, 500=0.19152 (USD); Number of Pins: 1; Material: Bronze; Contact Material: Bronze; Series: 5019; Termination: SMD/SMT; Height: 0.09inch; RoHS Compliant: Yes; Reach SVHC Compliant: Yes; Lead Free: Lead Free; ComponentLink3URL: https://datasheet.ciiva.com/16885/70182998-16885945.pdf?src-supplier=Allied+Electronics; ComponentLink3Description: https://datasheet.ciiva.com/16885/70182998-16885945.pdf?src-supplier=Allied+Electronics; ComponentLink4URL: https://datasheet.ciiva.com/14848/m60-2p61-14848437.pdf?src-supplier=Digi-Key; ComponentLink4Description: https://datasheet.ciiva.com/14848/m60-2p61-14848437.pdf?src-supplier=Digi-Key; ComponentLink5URL: https://datasheet.ciiva.com/14848/m60-2p61-14848438.pdf?src-supplier=Digi-Key; ComponentLink5Description: https://datasheet.ciiva.com/14848/m60-2p61-14848438.pdf?src-supplier=Digi-Key; ComponentLink6URL: https://datasheet.ciiva.com/14848/m60-2p61-14848439.pdf?src-supplier=Digi-Key; ComponentLink6Description: https://datasheet.ciiva.com/14848/m60-2p61-14848439.pdf?src-supplier=Digi-Key; ComponentLink7URL: https://datasheet.ciiva.com/16318/m60-2p61-16318395.pdf?src-supplier=Future+Electronics; ComponentLink7Description: https://datasheet.ciiva.com/16318/m60-2p61-16318395.pdf?src-supplier=Future+Electronics
U3-U5 = LMR51420YDDCR: SIMPLE SWITCHER® power converter 4.5-V to 36-V, 2-A, synchronous buck with 40-µA IQ 6-SOT-23-THIN -40 to 150; Manufacturer: Texas Instruments; Supplier 1: Mouser; Manufacturer Part Number: LMR51420YDDCR; RoHS: No; Category: Integrated Circuits (ICs); Stock 1: 4911; Pricing 1: 1=1.56000, 10=1.41000, 25=1.33000, 50=1.33000, 100=1.13000, 250=1.06000, 500=0.92800, 1000=0.77000, 3000=0.76900, 10000=0.76900 (USD); Supplier Part Number 1: 595-LMR51420YDDCR; Supplier 2: Digi-Key; Stock 2: 5954; Pricing 2: 1=1.56000, 10=1.40400, 25=1.32480, 100=1.12890, 250=1.06000, 500=0.92750, 1000=0.76850 (USD); Supplier Part Number 2: 296-LMR51420YDDCRCT-ND
U6 U7 = CMP-0130-00068-1: 1Î¼A Voltage Detector, Open-Drain Output, 4.5V, 3-Pin SOT-23A, Industrial Temperature, Tape and Reel; Manufacturer: Microchip; Package Body Material: Plastic; Adjustable Threshold: No; Analog IC - Other Type: POWER SUPPLY SUPPORT CIRCUIT; Number of Channels: 1; Package Equivalence Code: TO-236; Power Supplies: 0.7/10V; Supply Current-Max (Isup): 4uA; Supply Voltage-Max (Vsup): 10V; Supply Voltage-Min (Vsup): 700mV; Supply Voltage-Nom (Vsup): 2.1V; Time @ Peak Reflow Temperature-Max (s): 40s; Qualification Status: Not Qualified; PackageDescription: 3-Lead Plastic Small Outline Transistor (CB) [SOT-23A]; PackageVersion: revBB, Aug-2009; DatasheetVersion: revH, Dec-2007; PackageReference: SOT-23A-CB3; Supplier 1: Digi-Key; Manufacturer Part Number: TC54VN4502ECB713; RoHS: Yes; Category: Voltage Supervisors; Stock 1: 174; Pricing 1: 1=0.76000, 25=0.62560, 100=0.57240 (USD); Package Code: TSSOP; Number of Pins: 3; Package Shape: Rectangular; Terminal Finish: Tin; Min Operating Temperature: -40°C; Max Operating Temperature: 85°C; JESD-609 Code: e3; JESD-30 Code: R-PDSO-G3; Moisture Sensitivity Level: 1; Number of Functions: 1; Package Style: SMALL OUTLINE, THIN PROFILE, SHRINK PITCHMeter; Peak Reflow Temperature (Cel): 260°C; Surface Mount: Yes; Technology: CMOS; Terminal Form: Gull Wing; Terminal Position: DUAL; Threshold Voltage-Nom: 4.5V; Length: 2.92mm; Width: 1.3mm; Height - Seated (Max): 1.12mm; Terminal Pitch: 0.95mm; Temperature Grade: INDUSTRIAL; Reach SVHC Compliant: Yes; RoHS Compliant: Yes; ComponentLink1URL: https://datasheet.ciiva.com:443/pdfs/VipMasterIC/IC/MCHP/MCHPS01610/MCHPS01610-1.pdf?src-supplier=IHS+Markit; ComponentLink1Description: https://datasheet.ciiva.com:443/pdfs/VipMasterIC/IC/MCHP/MCHPS01610/MCHPS01610-1.pdf?src-supplier=IHS+Markit; ComponentLink2URL: https://datasheet.ciiva.com/41463/001085661-da-01-en-ic-volt-det-tc54vn4502ecb713-t23a-so-mcp-41463347.pdf?src-supplier=Conrad; ComponentLink2Description: https://datasheet.ciiva.com/41463/001085661-da-01-en-ic-volt-det-tc54vn4502ecb713-t23a-so-mcp-41463347.pdf?src-supplier=Conrad; ComponentLink3URL: https://datasheet.ciiva.com/1969/filehandler-aspxddocname-en011681-1969768.pdf?src-supplier=Digi-Key; ComponentLink3Description: https://datasheet.ciiva.com/1969/filehandler-aspxddocname-en011681-1969768.pdf?src-supplier=Digi-Key; ComponentLink4URL: https://datasheet.ciiva.com/1969/filehandler-aspxddocname-en011681-1969769.pdf?src-supplier=Digi-Key; ComponentLink4Description: https://datasheet.ciiva.com/1969/filehandler-aspxddocname-en011681-1969769.pdf?src-supplier=Digi-Key; ComponentLink5URL: https://datasheet.ciiva.com/1969/filehandler-aspxddocname-en011681-1969770.pdf?src-supplier=Digi-Key; ComponentLink5Description: https://datasheet.ciiva.com/1969/filehandler-aspxddocname-en011681-1969770.pdf?src-supplier=Digi-Key; ComponentLink6URL: https://datasheet.ciiva.com/9215/jp011681-9215305.pdf?src-supplier=Avnet; ComponentLink6Description: https://datasheet.ciiva.com/9215/jp011681-9215305.pdf?src-supplier=Avnet; ComponentLink7URL: https://datasheet.ciiva.com/16387/21434j-16387813.pdf?src-supplier=Future+Electronics; ComponentLink7Description: https://datasheet.ciiva.com/16387/21434j-16387813.pdf?src-supplier=Future+Electronics; ComponentLink8URL: https://datasheet.ciiva.com/7990/1669371-7990687.pdf?src-supplier=Element14; ComponentLink8Description: https://datasheet.ciiva.com/7990/1669371-7990687.pdf?src-supplier=Element14; ComponentLink9URL: https://datasheet.ciiva.com/22697/1669371-22697242.pdf?src-supplier=Element14; ComponentLink9Description: https://datasheet.ciiva.com/22697/1669371-22697242.pdf?src-supplier=Element14; ComponentLink10URL: https://datasheet.ciiva.com/28649/651108-28649830.pdf?src-supplier=Element14; ComponentLink10Description: https://datasheet.ciiva.com/28649/651108-28649830.pdf?src-supplier=Element14